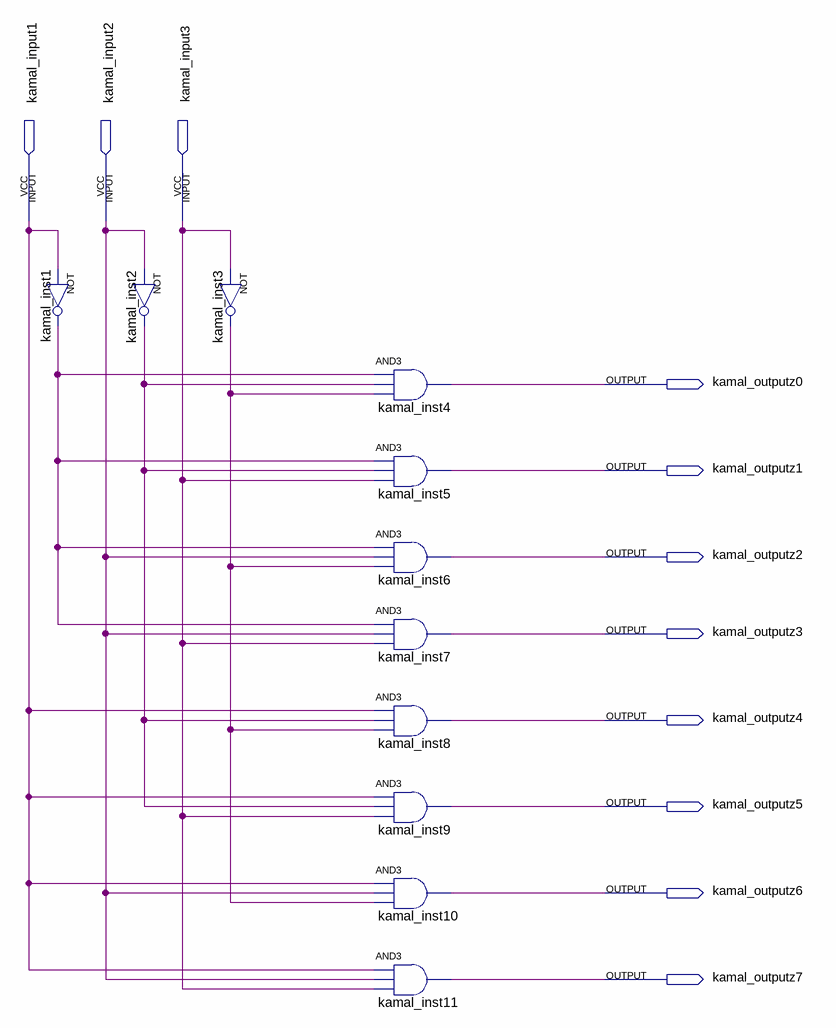
[diagram p0: schematic sheet]
// Quartus schematic kamal_lab1_3to8Decoder.bdf as structural Verilog: 11 symbols, 11 pins
module kamal_lab1_3to8Decoder (
  input  kamal_input1,
  input  kamal_input2,
  input  kamal_input3,
  output kamal_outputz0,
  output kamal_outputz1,
  output kamal_outputz2,
  output kamal_outputz3,
  output kamal_outputz4,
  output kamal_outputz5,
  output kamal_outputz6,
  output kamal_outputz7
);

  wire kamal_inst1_out, kamal_inst2_out, kamal_inst3_out;

  not kamal_inst1 (kamal_inst1_out, kamal_input1);
  not kamal_inst2 (kamal_inst2_out, kamal_input2);
  not kamal_inst3 (kamal_inst3_out, kamal_input3);
  and kamal_inst4 (kamal_outputz0, kamal_inst1_out, kamal_inst2_out, kamal_inst3_out);
  and kamal_inst5 (kamal_outputz1, kamal_inst1_out, kamal_inst2_out, kamal_input3);
  and kamal_inst6 (kamal_outputz2, kamal_inst1_out, kamal_input2, kamal_inst3_out);
  and kamal_inst7 (kamal_outputz3, kamal_inst1_out, kamal_input2, kamal_input3);
  and kamal_inst8 (kamal_outputz4, kamal_input1, kamal_inst2_out, kamal_inst3_out);
  and kamal_inst9 (kamal_outputz5, kamal_input1, kamal_inst2_out, kamal_input3);
  and kamal_inst10 (kamal_outputz6, kamal_input1, kamal_input2, kamal_inst3_out);
  and kamal_inst11 (kamal_outputz7, kamal_input1, kamal_input2, kamal_input3);
endmodule
